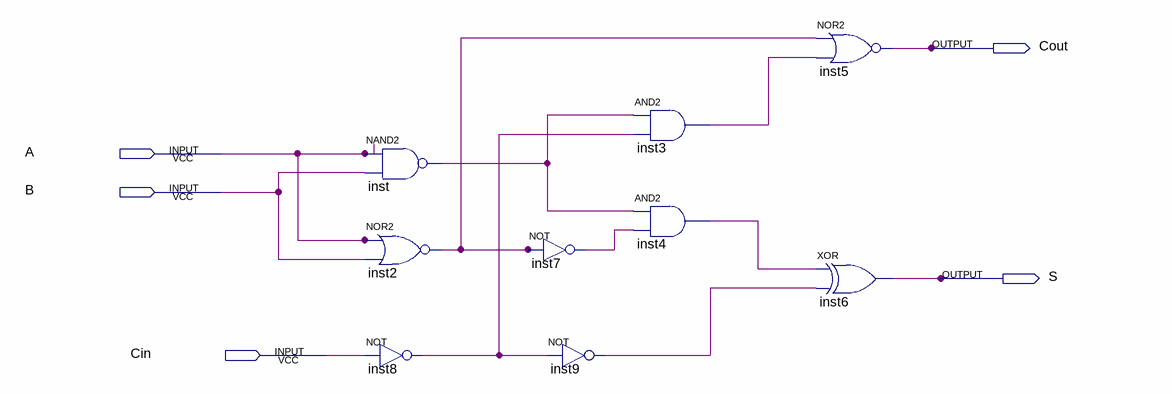
[diagram p0: schematic sheet]
// Quartus schematic Somador4Bits7Segmentos.bdf as structural Verilog: 9 symbols, 5 pins
module Somador4Bits7Segmentos (
  input  A,
  input  B,
  input  Cin,
  output Cout,
  output S
);

  wire inst2_out, inst3_out, inst4_out, inst7_out, inst8_out, inst9_out, inst_out;

  nand inst (inst_out, A, B);
  nor inst2 (inst2_out, A, B);
  not inst8 (inst8_out, Cin);
  not inst7 (inst7_out, inst2_out);
  not inst9 (inst9_out, inst8_out);
  and inst3 (inst3_out, inst_out, inst8_out);
  and inst4 (inst4_out, inst_out, inst7_out);
  nor inst5 (Cout, inst2_out, inst3_out);
  xor inst6 (S, inst4_out, inst9_out);
endmodule
